# EAGLE design TinyTankSchematic (EAGLE 8.4.1)
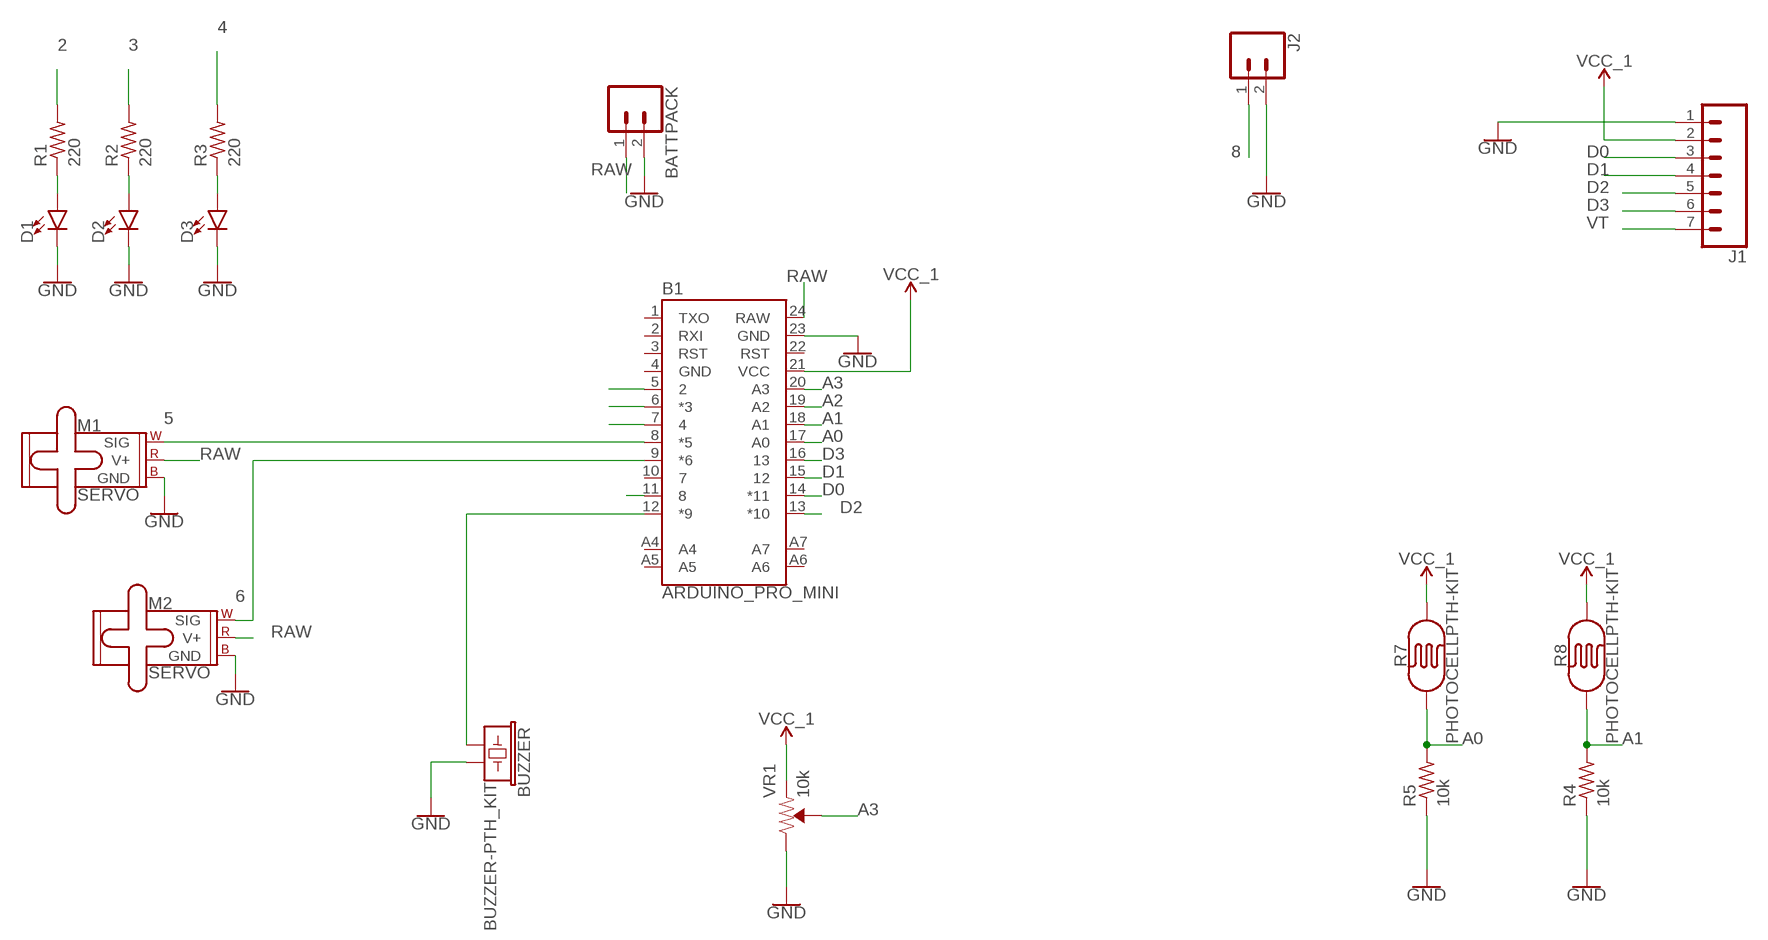
[diagram p0: schematic, sheet 1]

## Parts
B1  ARDUINO_PRO_MINI  [ARDUINO_PRO_MINI]
BATTPACK  CONN_02POLAR  [MOLEX-1X2]
BUZZER  BUZZER-PTH_KIT  [BUZZER-12MM-KIT]
D1  LED5MM  [LED_5MM]
D2  LED5MM  [LED_5MM]
D3  LED5MM  [LED_5MM]
J1  CONN_07  [1X07]
J2  CONN_02PTH3  [1X02_LONGPADS]
M1  SERVO  [1X03]
M2  SERVO  [1X03]
R1  220  R-US_0204/7  [0204/7]
R2  220  R-US_0204/7  [0204/7]
R3  220  R-US_0204/7  [0204/7]
R4  10k  R-US_0204/7  [0204/7]
R5  10k  R-US_0204/7  [0204/7]
R7  PHOTOCELLPTH-KIT  [PHOTOCELL-KIT]
R8  PHOTOCELLPTH-KIT  [PHOTOCELL-KIT]
VR1  10k  TRIMPOT-PTH-10MM-KNOB-1/2W-10%  [TRIMPOT-PTH-3386U]

## Nets
2: B1.5 R1.2
3: B1.6(*3) R2.2
4: B1.7 R3.2
5: B1.8(*5) M1.1(SIG)
6: B1.9(*6) M2.1(SIG)
8: B1.11 J2.1
A0: B1.17(A0) R5.2 R7.1
A1: B1.18(A1) R4.2 R8.1
A2: B1.19(A2)
A3: B1.20(A3) VR1.2(WIPER)
D0: B1.14(*11) J1.3
D1: B1.15 J1.4
D2: B1.13(*10) J1.5
D3: B1.16 J1.6
GND: B1.23(GND) BATTPACK.2 BUZZER.- D1.K(C) D2.K(C) D3.K(C) J1.1 J2.2 M1.3(GND) M2.3(GND) R4.1 R5.1 VR1.3(CW)
N$1: D1.A R1.1
N$2: D2.A R2.1
N$3: D3.A R3.1
N$4: B1.12(*9) BUZZER.+
RAW: B1.24(RAW) BATTPACK.1 M1.2(V+) M2.2(V+)
VCC_1: B1.21(VCC) J1.2 R7.2 R8.2 VR1.1(CCW)
VT: J1.7
Unconnected: B1.1(TXO) B1.2(RXI) B1.3(RST) B1.10 B1.22(RST) B1.A4 B1.A5 B1.A6 B1.A7

## Power pins joined to a net without a drawn wire
GND: B1.4(GND)

## Library data of the parts
B1 = SparkFun-Boards:ARDUINO_PRO_MINI: SparkFun Pro Mini Pro Mini compatible footprint. Dimensions: 0.7 x 1.3" PCB Thickness: 0.8mm SparkFun Products: 3.3V/8MHz <https://www.sparkfun.com/products/11114> 5V/16MHz <https://www.sparkfun.com/products/11113>
BATTPACK = SparkFun-Connectors:CONN_02: Multi connection point. Often used as Generic Header-pin footprint for 0.1 inch spaced/style header connections On any of the 0.1 inch spaced packages, you can populate with these: Break Away Headers - Straight <https://www.sparkfun.com/products/116> (PRT-00116) Break Away Male Headers - Right Angle <https://www.sparkfun.com/products/553> (PRT-00553) Female Headers <https://www.sparkfun.com/products/115> (PRT-00115) Break Away Headers - Machine Pin <https://www.sparkfun.com/products/117> (PRT-00117) Break Away Female Headers - Swiss Machine Pin <https://www.sparkfun.com/products/743> (PRT-00743) For SCREWTERMINALS and SPRING TERMINALS visit here: Screw Terimnals on SparkFun.com <https://www.sparkfun.com/search/results?term=Screw+Terminals> (5mm/3.5mm/2.54mm spacing) This device is also useful as a general connection point to wire up your design to another part of your project. Our various solder wires solder well into these plated through hole pads. Hook-Up Wire - Assortment (Stranded, 22 AWG) <https://www.sparkfun.com/products/11375> (PRT-11375) Hook-Up Wire - Assortment (Solid Core, 22 AWG) <https://www.sparkfun.com/products/11367> (PRT-11367) View the entire wire category on our website here <https://www.sparkfun.com/categories/141> Special notes: Molex polarized connector foot print use with: PRT-08233 with associated crimp pins and housings. 2.54_SCREWTERM for use with PRT-10571. 3.5mm Screw Terminal footprints for PRT-08084 5mm Screw Terminal footprints for use with PRT-08432; SF_ID: PRT-09918
BUZZER = SparkFun-Electromechanical:BUZZER: Buzzer Small round buzzers that operate around the audible 2kHz range. You can use these as speakers to create simple music or user interfaces. Variant Overview: PTH - Mini Speaker - PC Mount 12mm 2.048kHz <https://www.sparkfun.com/products/7950> PTH_KIT - Mini Speaker - PC Mount 12mm 2.048kHz <https://www.sparkfun.com/products/7950> KIT simplifies soldering by adding stop mask to one side of the pads. PTH_NO_SILK - Mini Speaker - PC Mount 12mm 2.048kHz <https://www.sparkfun.com/products/7950> No silkscreen indicator of buzzer outline. PTH_KIT_NO_SILK - Mini Speaker - PC Mount 12mm 2.048kHz <https://www.sparkfun.com/products/7950> KIT package w/o silkscreen SMD - Buzzer Audio Magnetic (CCV-084B16) SMD buzzer used on, e.g. the LilyPad Buzzer <https://www.sparkfun.com/products/8463> and RFID USB Reader <https://www.sparkfun.com/products/9963>. SMD_KIT - Buzzer Audio Magnetic (CCV-084B16) SMD Buzzer with elongated pins to make soldering easier. Used on the SparkFun Simon Says - Surface Mount Soldering Kit <https://www.sparkfun.com/products/10935>.; PROD_ID: COMP-08253; SF_SKU: COM-07950
D1-D3 = SparkFun-LED:LED: LED (Generic) Standard schematic elements and footprints for 5mm, 3mm, 1206, and 0603 sized LEDs. Generic LEDs with no color specified.
J1 = SparkFun-Connectors:CONN_07: Multi connection point. Often used as Generic Header-pin footprint for 0.1 inch spaced/style header connections On any of the 0.1 inch spaced packages, you can populate with these: Break Away Headers - Straight <https://www.sparkfun.com/products/116> (PRT-00116) Break Away Male Headers - Right Angle <https://www.sparkfun.com/products/553> (PRT-00553) Female Headers <https://www.sparkfun.com/products/115> (PRT-00115) Break Away Headers - Machine Pin <https://www.sparkfun.com/products/117> (PRT-00117) Break Away Female Headers - Swiss Machine Pin <https://www.sparkfun.com/products/743> (PRT-00743) For SCREWTERMINALS and SPRING TERMINALS visit here: Screw Terimnals on SparkFun.com <https://www.sparkfun.com/search/results?term=Screw+Terminals> (5mm/3.5mm/2.54mm spacing) This device is also useful as a general connection point to wire up your design to another part of your project. Our various solder wires solder well into these plated through hole pads. Hook-Up Wire - Assortment (Stranded, 22 AWG) <https://www.sparkfun.com/products/11375> (PRT-11375) Hook-Up Wire - Assortment (Solid Core, 22 AWG) <https://www.sparkfun.com/products/11367> (PRT-11367) View the entire wire category on our website here <https://www.sparkfun.com/categories/141> Special notes: Molex polarized connector foot print use with SKU : PRT-08231 with associated crimp pins and housings. 1MM SMD Version SKU: PRT-10208 NOTES ON THE VARIANTS LOCK and LOCK_LONGPADS... This footprint was designed to help hold the alignment of a through-hole component (i.e. 6-pin header) while soldering it into place. You may notice that each hole has been shifted either up or down by 0.005 of an inch from it's more standard position (which is a perfectly straight line). This slight alteration caused the pins (the squares in the middle) to touch the edges of the holes. Because they are alternating, it causes a "brace" to hold the component in place. 0.005 has proven to be the perfect amount of "off-center" position when using our standard breakaway headers. Although looks a little odd when you look at the bare footprint, once you have a header in there, the alteration is very hard to notice. Also,if you push a header all the way into place, it is covered up entirely on the bottom side.
J2 = SparkFun-Connectors:CONN_02: Multi connection point. Often used as Generic Header-pin footprint for 0.1 inch spaced/style header connections On any of the 0.1 inch spaced packages, you can populate with these: Break Away Headers - Straight <https://www.sparkfun.com/products/116> (PRT-00116) Break Away Male Headers - Right Angle <https://www.sparkfun.com/products/553> (PRT-00553) Female Headers <https://www.sparkfun.com/products/115> (PRT-00115) Break Away Headers - Machine Pin <https://www.sparkfun.com/products/117> (PRT-00117) Break Away Female Headers - Swiss Machine Pin <https://www.sparkfun.com/products/743> (PRT-00743) For SCREWTERMINALS and SPRING TERMINALS visit here: Screw Terimnals on SparkFun.com <https://www.sparkfun.com/search/results?term=Screw+Terminals> (5mm/3.5mm/2.54mm spacing) This device is also useful as a general connection point to wire up your design to another part of your project. Our various solder wires solder well into these plated through hole pads. Hook-Up Wire - Assortment (Stranded, 22 AWG) <https://www.sparkfun.com/products/11375> (PRT-11375) Hook-Up Wire - Assortment (Solid Core, 22 AWG) <https://www.sparkfun.com/products/11367> (PRT-11367) View the entire wire category on our website here <https://www.sparkfun.com/categories/141> Special notes: Molex polarized connector foot print use with: PRT-08233 with associated crimp pins and housings. 2.54_SCREWTERM for use with PRT-10571. 3.5mm Screw Terminal footprints for PRT-08084 5mm Screw Terminal footprints for use with PRT-08432
M1 M2 = SparkFun-Electromechanical:SERVO: Servo Motor 3-pin connector for a standard servo motor (voltage supply, ground, and control signal.) SparkFun Products Servo - Generic (Sub-Micro Size) <https://www.sparkfun.com/products/9065> (ROB-09065) Servo - Generic High Torque Continuous Rotation (Standard Size) <https://www.sparkfun.com/products/9347> (ROB-09347) Servo - Generic High Torque (Standard Size) <https://www.sparkfun.com/products/11965> (ROB-11965)
R1-R5 = adafruit:R-US_: RESISTOR, American symbol
R7 R8 = SparkFun-Sensors:PHOTOCELL: Photocell (Photodetector, Photo Resistor, CdS) This is a very small light sensor. A photocell changes (also called a photodetector, photo resistor, CdS or photoconductive cell) resistance depending on the amount of light it is exposed to. These little sensors make great ambient light triggers (when light in the room turns on, do something). Datasheet <http://cdn.sparkfun.com/datasheets/Sensors/LightImaging/SEN-09088.pdf> SparkFun Products Mini Photocell <https://www.sparkfun.com/products/9088> (SEN-09088); PROD_ID: COMP-09129; SF_ID: SEN-09088
VR1 = SparkFun-Resistors:TRIMPOT: Trimming Potentiometer (Trimpot) Three-terminal potentiometers, with an adjustable wiper and two adjustable resistors. A pot can be used to create a configurable voltage divider, or as a variable resistor. "Trimpots" are a subset of potentiometers, usually intended for "set-and-forget" applications. They're often more delicate than standard potentiometers - rated for fewer turns. Variants PTH-KNOB - PTH Trimpot w/ finger-adjustable knob Trimpot 10K with Knob <https://www.sparkfun.com/products/9806> (COM-09806) Datasheet <http://www.sparkfun.com/datasheets/Components/General/TSR-3386.pdf> SMD-3MM-CLOSED-FRAME - SMD 3mm Square Closed-Frame Trimpot Used on e.g. EasyDriver - Stepper Motor Driver <https://www.sparkfun.com/products/12779> Datasheet <http://www.bitechnologies.com/pdfs/22.pdf> (22AR10KTR) SMD-5MM - SMD 5mm Square Closed-Frame Trimpot Used on e.g. IOIO-OTG - V2.2 <https://www.sparkfun.com/products/13613> Datasheet <http://www.vishay.com/docs/51008/ts53.pdf> (TS53YL502MR10) SMD-3MM-1/10W-25% - 3mm Square Open-Frame Trimpot Used on e.g. SparkFun Shapeoko <https://www.sparkfun.com/products/13899> Datasheet <http://www.bourns.com/docs/Product-Datasheets/TC33.pdf> (TC33X-2-103E); PROD_ID: RES-09730; SF_SKU: COM-09806

## Board
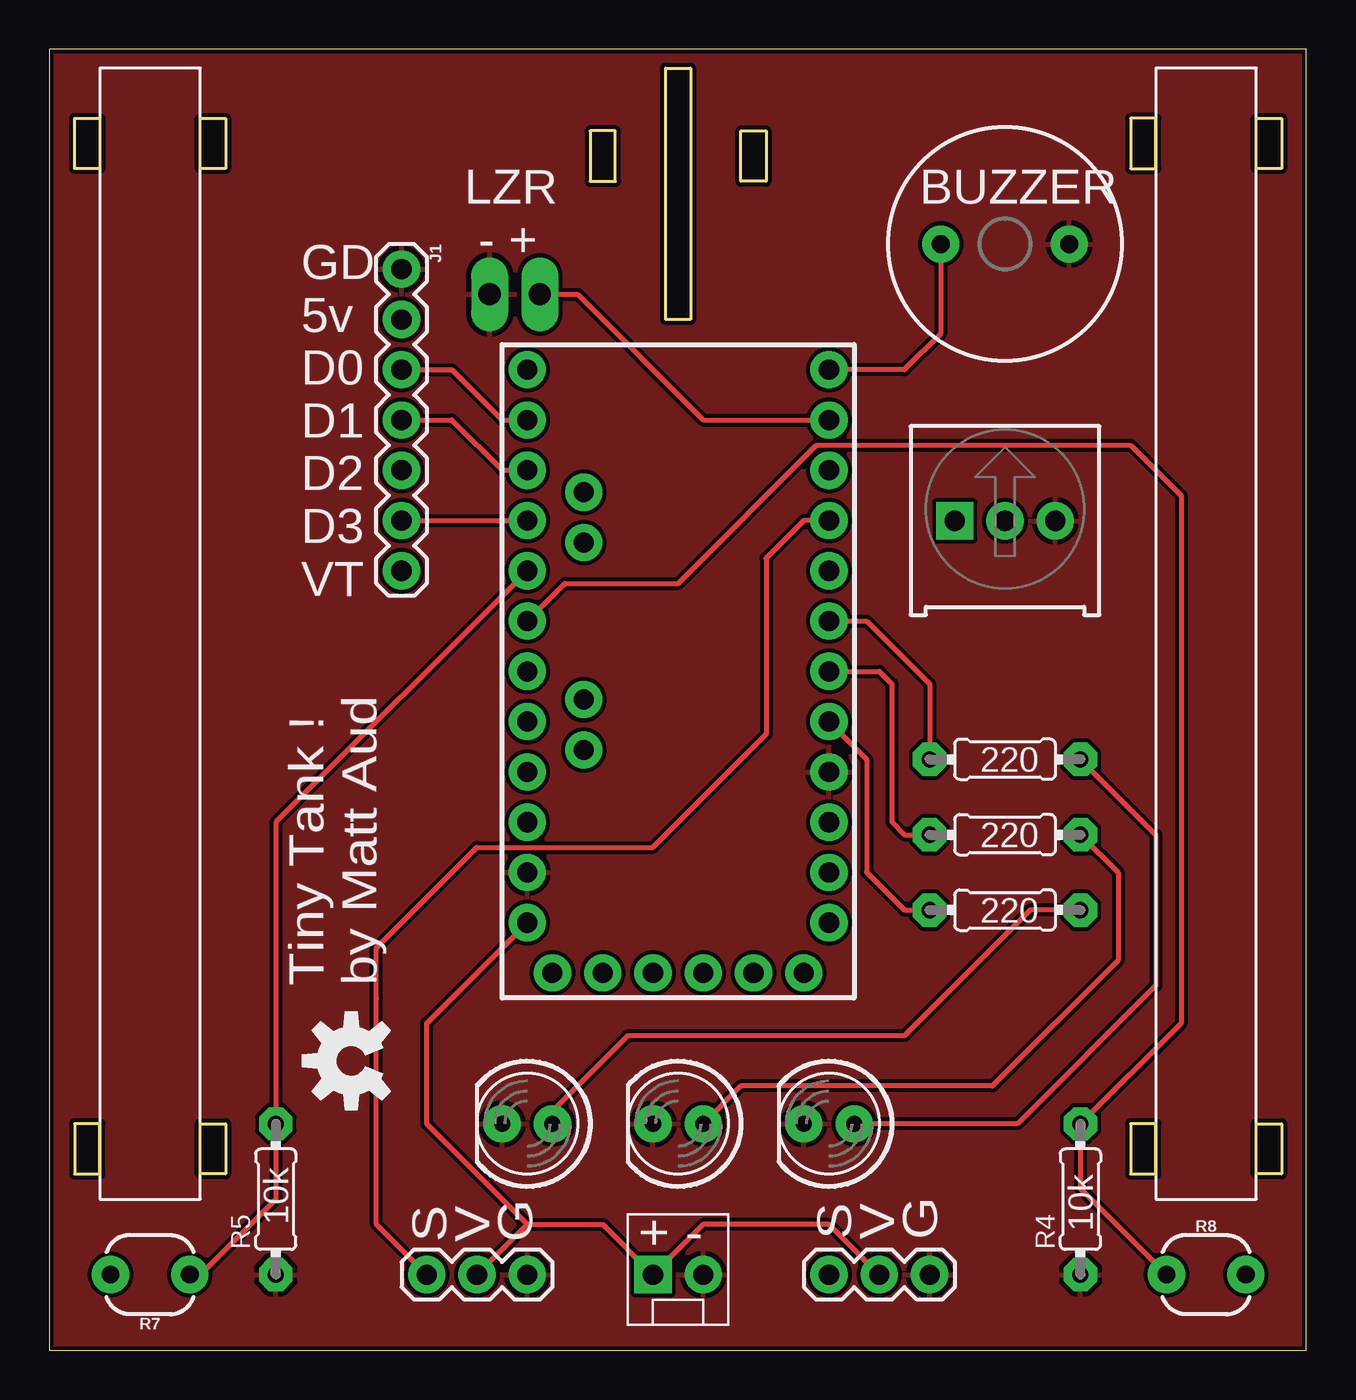
[diagram p1: board, top side]
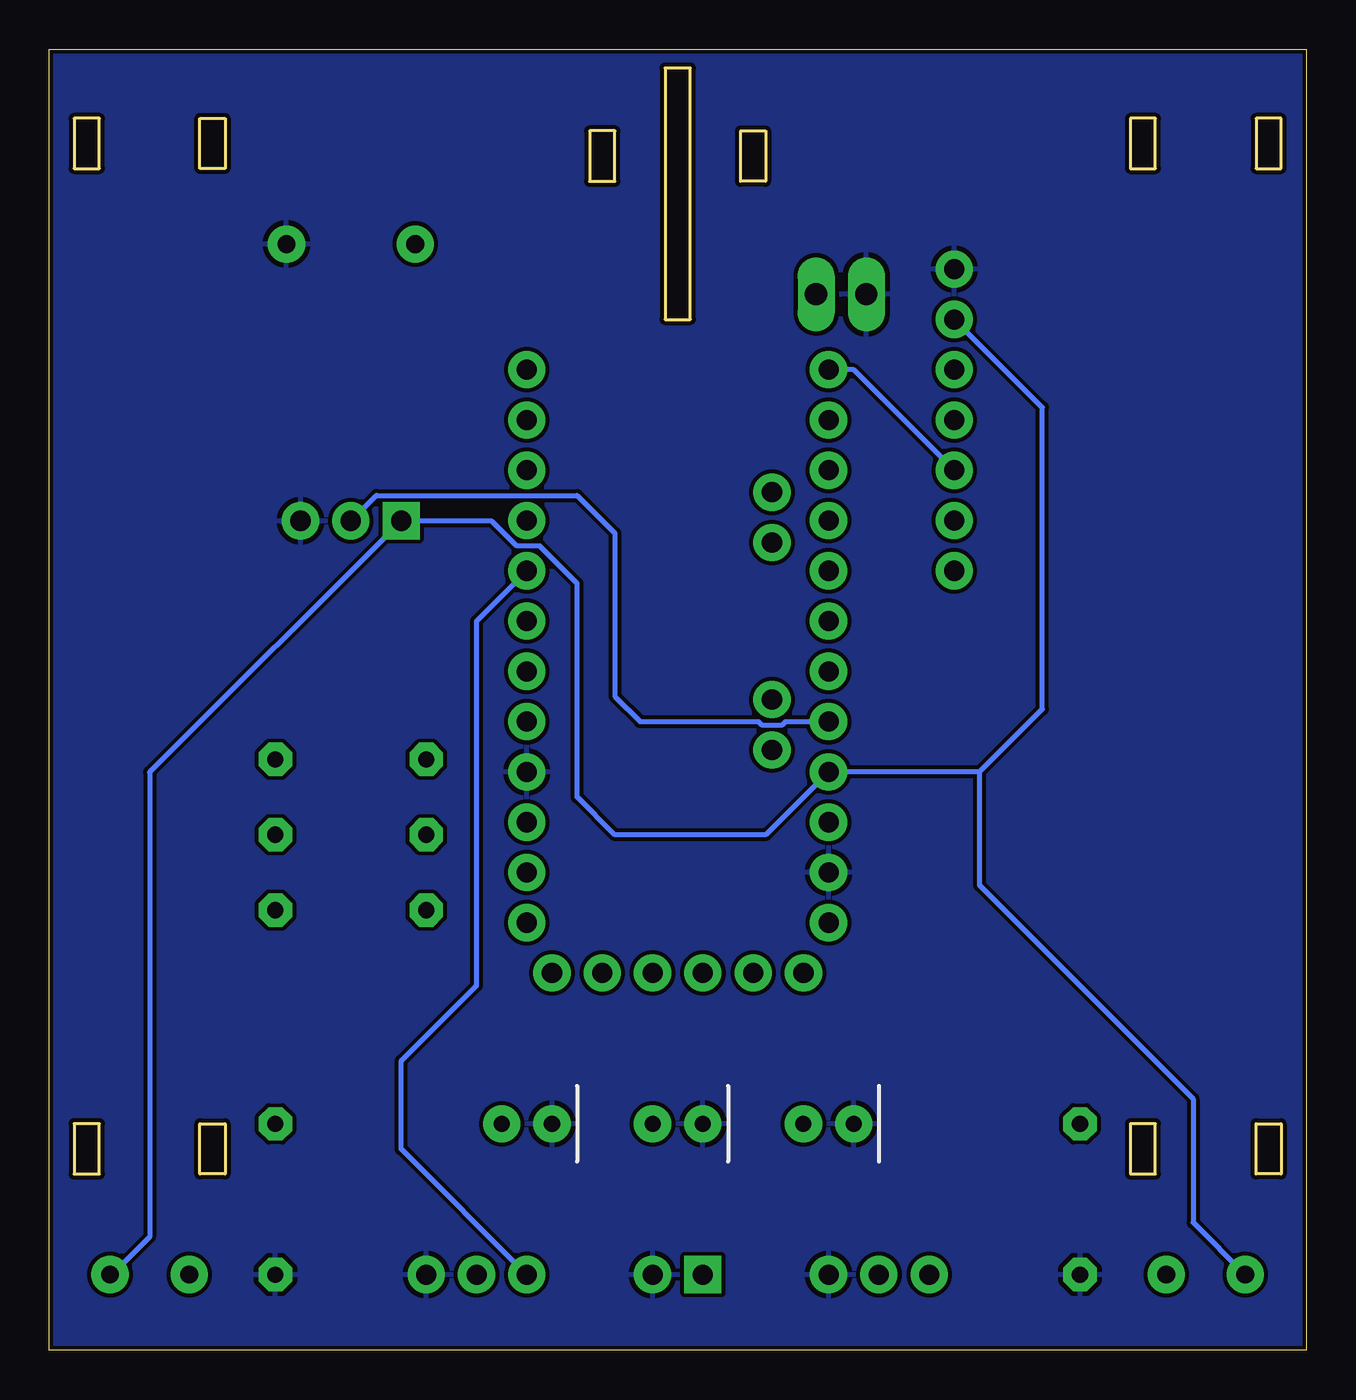
[diagram p2: board, bottom side, seen from below]

Size 63.48 x 65.71 mm. Coordinates in mm from the lower left corner, seen from the top.
Outline: 0,0 63.48,0 63.48,65.71 0,65.71 0,0
Outline: 1.27,62.23 2.54,62.23 2.54,59.69 1.27,59.69 1.27,62.23
Outline: 7.62,62.23 8.89,62.23 8.89,59.69 7.62,59.69 7.62,62.23
Outline: 55.88,62.23 54.61,62.23 54.61,59.69 55.88,59.69 55.88,62.23
Outline: 60.96,62.23 62.23,62.23 62.23,59.69 60.96,59.69 60.96,62.23
Outline: 60.96,11.43 62.23,11.43 62.23,8.89 60.96,8.89 60.96,11.43
Outline: 55.88,11.43 54.61,11.43 54.61,8.89 55.88,8.89 55.88,11.43
Outline: 7.62,11.43 8.89,11.43 8.89,8.89 7.62,8.89 7.62,11.43
Outline: 2.54,11.43 1.27,11.43 1.27,8.89 2.54,8.89 2.54,11.43
Outline: 31.11,64.77 32.38,64.77 32.38,52.07 31.11,52.07 31.11,64.77
Outline: 28.57,61.59 27.3,61.59 27.3,59.05 28.57,59.05 28.57,61.59
Outline: 34.92,61.59 36.2,61.59 36.2,59.05 34.92,59.05 34.92,61.59
Copper layers (1*16): Top 0.035mm / dielectric 1.5mm / Bottom 0.035mm
Design rules "SparkFun": minimum track width 8mil, minimum drill 20mil, track to track 8mil, track to pad 8mil, pad to pad 8mil, via to via 8mil, smd to smd 8mil, copper to edge 8mil, drill to drill 8mil, minimum pad ring 12mil, minimum via ring 10mil, stop-mask expansion 4mil, vias tented up to drill 20mil, thermal gap 10mil

### Footprints (pad centres in the part's own frame; a part is rotated, then mirrored left to right if it is on the bottom)
ARDUINO_PRO_MINI = drill 1.016 pad 1.88: 1 -7.62,12.7; 2 -7.62,10.16; 3 -7.62,7.62; 4 -7.62,5.08; 5 -7.62,2.54; 6 -7.62,0; 7 -7.62,-2.54; 8 -7.62,-5.08; 9 -7.62,-7.62; 10 -7.62,-10.16; 11 -7.62,-12.7; 12 -7.62,-15.24; 13 7.62,-15.24; 14 7.62,-12.7; 15 7.62,-10.16; 16 7.62,-7.62; 17 7.62,-5.08; 18 7.62,-2.54; 19 7.62,0; 20 7.62,2.54; 21 7.62,5.08; 22 7.62,7.62; 23 7.62,10.16; 24 7.62,12.7; A4 4.763,1.429; A5 4.763,3.969; A6 4.763,-9.049; A7 4.763,-6.509; BLK -6.35,15.24; GND -3.81,15.24; GRN 6.35,15.24; RXI 1.27,15.24; TXO 3.81,15.24; VCC -1.27,15.24
MOLEX-1X2 = drill 1.016 pad 1.88 square: 1 0,0 | drill 1.016 pad 1.88: 2 2.54,0
BUZZER-12MM-KIT = drill 0.9 pad 1.88: + 3.25,0; - -3.25,0
LED_5MM = drill 0.813 pad 1.88: A -1.27,0; K 1.27,0
1X07 = drill 1.016 pad 1.88: 1 0,0; 2 2.54,0; 3 5.08,0; 4 7.62,0; 5 10.16,0; 6 12.7,0; 7 15.24,0
1X02_LONGPADS = drill 1.118 pad 1.88 long: 1 0,0; 2 2.54,0
1X03 = drill 1.016 pad 1.88: 1 0,0; 2 2.54,0; 3 5.08,0
0204/7 = drill 0.813 pad 1.676 octagon: 1 -3.81,0; 2 3.81,0
PHOTOCELL-KIT = drill 0.9 pad 1.88: 1 -2,0; 2 2,0
TRIMPOT-PTH-3386U = drill 1.016 pad 1.88 square: 1 -2.54,-0.015 | drill 1.016 pad 1.88: 2 0,-0.015; 3 2.54,-0.015

### Placement (x,y rotation side)
B1  31.75,34.29 180 top
BATTPACK  30.48,3.81 0 top
BUZZER  48.26,55.88 180 top
D1  24.13,11.43 180 top
D2  31.75,11.43 180 top
D3  39.37,11.43 180 top
J1  17.78,54.61 270 top
J2  24.77,53.34 180 top
M1  39.37,3.81 0 top
M2  19.05,3.81 0 top
R1  48.26,22.23 180 top
R2  48.26,26.04 180 top
R3  48.26,29.84 180 top
R4  52.07,7.62 90 top
R5  11.43,7.62 90 top
R7  5.08,3.81 180 top
R8  58.42,3.81 0 top
U$1  [OSHW-LOGO-M]  15.24,14.61 90 top
VR1  48.26,41.91 0 top

### Tracks (layer width: path | path; a pad name or v marks a point on that pad's centre or on a via)
2
  Top 0.254: B1.5 41.27,29.84 41.27,24.13 43.18,22.23 R1.2
3
  Top 0.254: B1.6 41.91,34.29 42.55,33.66 42.55,26.67 43.18,26.04 R2.2
4
  Top 0.254: B1.7 41.27,36.83 44.45,33.66 R3.2
5
  Bottom 0.254: M1.1 45.72,10.16 45.72,14.61 41.91,18.41 41.91,36.83 B1.8
6
  Top 0.254: M2.1 16.51,6.35 16.51,17.78 16.51,20.32 18.41,22.23 21.59,25.4 30.48,25.4 36.2,31.11 36.2,40.01 38.1,41.91 B1.9
8
  Top 0.254: 24.77,53.2 J2.1 26.67,53.34 33.02,46.99 B1.11
A0
  Top 0.254: R7.1 7.62,3.81 11.43,7.62 R5.2 11.43,26.67 B1.17
A1
  Top 0.254: R8.1 52.07,8.16 R4.2 57.15,16.51 57.15,43.18 54.61,45.72 38.73,45.72 31.75,38.73 26.04,38.73 B1.18
A3
  Bottom 0.254: VR1.2 46.98,43.18 36.83,43.18 34.92,41.27 34.92,33.02 33.66,31.75 27.67,31.75 27.51,31.59 26.46,31.59 26.3,31.75 B1.20
D0
  Top 0.254: J1.3 20.32,49.53 22.86,46.99 B1.14
D1
  Top 0.254: J1.4 20.32,46.99 22.86,44.45 B1.15
D2
  Bottom 0.254: J1.5 22.86,49.53 B1.13
D3
  Top 0.254: J1.6 B1.16
GND
  pour Top: 0,65.41 64.14,65.41 64.14,0 62.87,-1.27 0,-1.27 -1.91,0.64 -1.91,63.5
  pour Bottom: -1.91,66.67 62.87,66.67 65.41,64.14 65.41,-0.64 64.14,-1.91 -1.27,-1.91 -1.91,-1.27
N$1
  Top 0.254: R1.1 49.53,22.23 43.18,15.88 29.21,15.88 25.4,12.06 D1.A
N$2
  Top 0.254: R2.1 53.98,24.13 53.98,19.68 47.62,13.34 34.92,13.34 D2.A
N$3
  Top 0.254: R3.1 55.88,26.04 55.88,18.41 48.9,11.43 D3.A
N$4
  Top 0.254: BUZZER.+ 45.01,51.36 43.18,49.53 B1.12
RAW
  Top 0.254: M2.2 24.13,6.35 | 24.13,6.35 27.94,6.35 BATTPACK.1 33.02,6.35 39.37,6.35 M1.2 | B1.24 19.05,16.51 19.05,11.43 24.13,6.35
VCC_1
  Bottom 0.254: 16.51,29.21 13.34,32.38 13.34,47.62 J1.2 | 16.51,29.21 B1.21 27.3,26.04 34.92,26.04 36.83,27.94 36.83,38.73 38.73,40.64 39.9,40.64 41.15,41.9 VR1.1 58.42,29.2 58.42,5.71 60.33,3.81 R8.2 | 16.51,29.21 16.51,23.5 5.71,12.7 5.71,6.45 R7.2

### Text on the board
tPlace: BUZZER | LZR / - + | GD / 5v / D0 / D1 / D2 / D3 / VT | 220 | 220 | 220 | Tiny Tank ! / by Matt Aud | 10k | 10k | S / V / G | S / V / G | + -